# EAGLE design BD0005 (EAGLE 9.6.2)
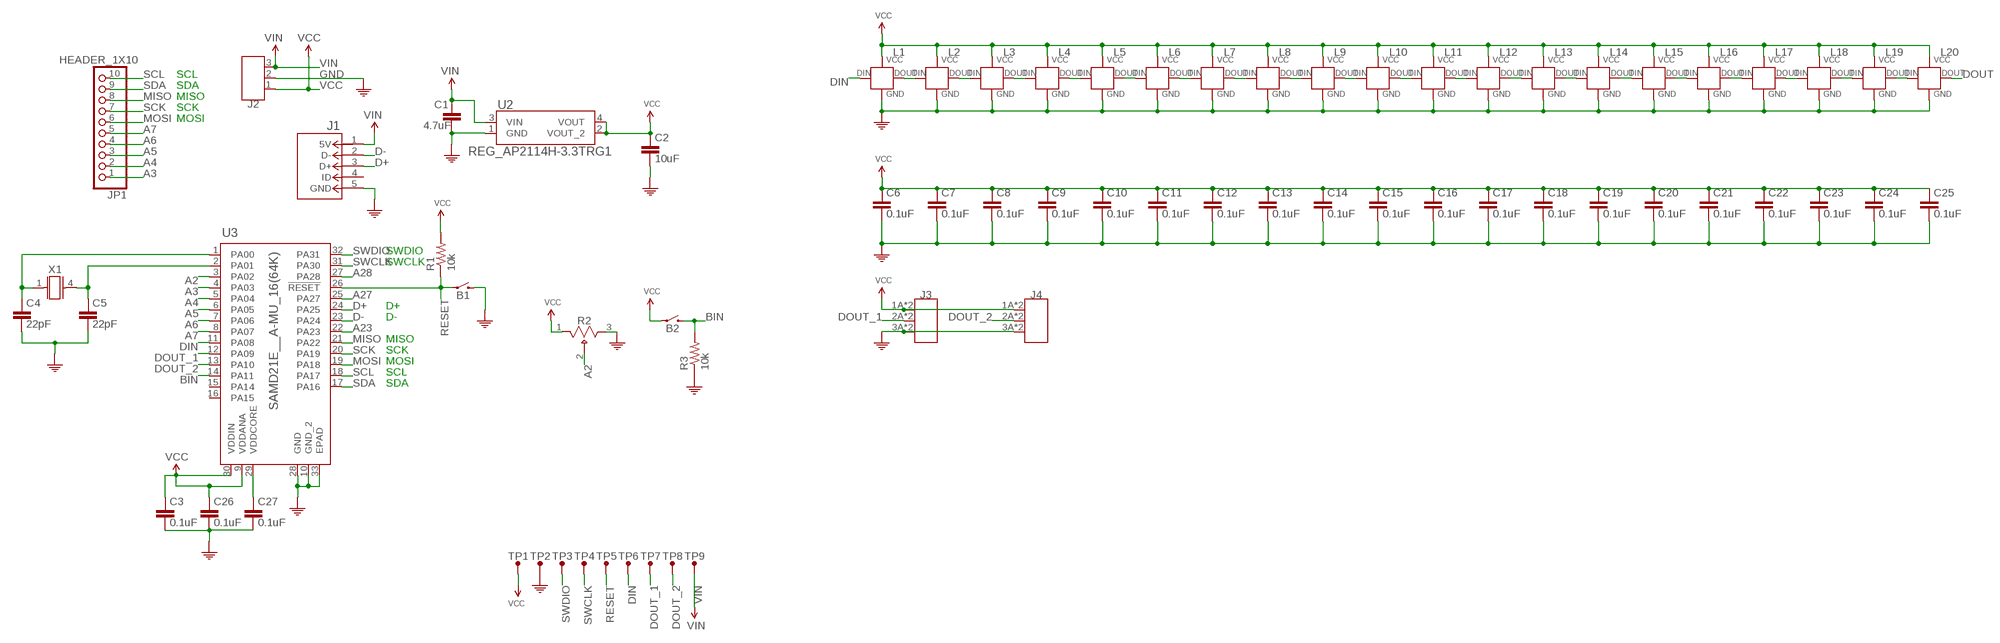
[diagram p0: schematic, sheet 1]

## Parts
B1  SWITCH_EVQ-P7A01P  [4-SMD_BUTTON]
B2  SWITCH_EVQ-P7A01P  [4-SMD_BUTTON]
C1  4.7uF  CAPACITOR-0402  [0402]
C2  10uF  CAPACITOR-0402  [0402]
C3  0.1uF  CAPACITOR-0402  [0402]
C4  22pF  CAPACITOR-0402  [0402]
C5  22pF  CAPACITOR-0402  [0402]
C6  0.1uF  CAPACITOR-0402  [0402]
C7  0.1uF  CAPACITOR-0402  [0402]
C8  0.1uF  CAPACITOR-0402  [0402]
C9  0.1uF  CAPACITOR-0402  [0402]
C10  0.1uF  CAPACITOR-0402  [0402]
C11  0.1uF  CAPACITOR-0402  [0402]
C12  0.1uF  CAPACITOR-0402  [0402]
C13  0.1uF  CAPACITOR-0402  [0402]
C14  0.1uF  CAPACITOR-0402  [0402]
C15  0.1uF  CAPACITOR-0402  [0402]
C16  0.1uF  CAPACITOR-0402  [0402]
C17  0.1uF  CAPACITOR-0402  [0402]
C18  0.1uF  CAPACITOR-0402  [0402]
C19  0.1uF  CAPACITOR-0402  [0402]
C20  0.1uF  CAPACITOR-0402  [0402]
C21  0.1uF  CAPACITOR-0402  [0402]
C22  0.1uF  CAPACITOR-0402  [0402]
C23  0.1uF  CAPACITOR-0402  [0402]
C24  0.1uF  CAPACITOR-0402  [0402]
C25  0.1uF  CAPACITOR-0402  [0402]
C26  0.1uF  CAPACITOR-0402  [0402]
C27  0.1uF  CAPACITOR-0402  [0402]
J1  CONN_MICROUSB_FEMALE  [CON00679_5]
J2  HEADER_1X3  [1X03-CLEANBIG]
J3  HEADER_1X3FEMALE  [F3SMD_RIGHTANGLE]
J4  HEADER_1X3FEMALE  [F3SMD_RIGHTANGLE]
JP1  HEADER_1X10  [1X10-BIG]
L1  WS2812B-B  [SK6812-B]
L2  WS2812B-B  [SK6812-B]
L3  WS2812B-B  [SK6812-B]
L4  WS2812B-B  [SK6812-B]
L5  WS2812B-B  [SK6812-B]
L6  WS2812B-B  [SK6812-B]
L7  WS2812B-B  [SK6812-B]
L8  WS2812B-B  [SK6812-B]
L9  WS2812B-B  [SK6812-B]
L10  WS2812B-B  [SK6812-B]
L11  WS2812B-B  [SK6812-B]
L12  WS2812B-B  [SK6812-B]
L13  WS2812B-B  [SK6812-B]
L14  WS2812B-B  [SK6812-B]
L15  WS2812B-B  [SK6812-B]
L16  WS2812B-B  [SK6812-B]
L17  WS2812B-B  [SK6812-B]
L18  WS2812B-B  [SK6812-B]
L19  WS2812B-B  [SK6812-B]
L20  WS2812B-B  [SK6812-B]
R1  10k  RESISTOR-0402  [0402]
R2  POT_THUMBWHEEL_3352T-1-104LF  [THUMBWHEEL]
R3  10k  RESISTOR-0402  [0402]
TP1  VCC  TEST_POINT  [TEST_POINT]
TP2  GND  TEST_POINT  [TEST_POINT]
TP3  DIO  TEST_POINT  [TEST_POINT]
TP4  CLK  TEST_POINT  [TEST_POINT]
TP5  RST  TEST_POINT  [TEST_POINT]
TP6  DIN  TEST_POINT  [TEST_POINT]
TP7  DO1  TEST_POINT  [TEST_POINT]
TP8  DO2  TEST_POINT  [TEST_POINT]
TP9  VIN  TEST_POINT  [TEST_POINT]
U2  REG_AP2114H-3.3TRG1  [SOT-223]
U3  SAMD21E__A-MU_16(64K)  [QFN32_5X5MC_MCH]
X1  XTAL_MC-146-32.7680JKA-A0:ROHS  [4-SMD_FLAT_LEADS]

## Nets
A2: R2.2 U3.3(PA02)
A3: JP1.1 U3.4(PA03)
A4: JP1.2 U3.5(PA04)
A5: JP1.3 U3.6(PA05)
A6: JP1.4 U3.7(PA06)
A7: JP1.5 U3.8(PA07)
A23: U3.22(PA23)
A27: U3.25(PA27)
A28: U3.27(PA28)
BIN: B2.2A B2.2B R3.P$2 U3.14(PA11)
D+: J1.3(D+) U3.24(PA25)
D-: J1.2(D-) U3.23(PA24)
DIN: L1.2(DIN) TP6.P$1 U3.11(PA08)
DOUT: L20.4(DOUT)
DOUT_1: J3.2A J3.2B TP7.P$1 U3.12(PA09)
DOUT_2: J4.2A J4.2B TP8.P$1 U3.13(PA10)
GND: B1.2A B1.2B C1.P$2 C2.P$2 C3.P$2 C4.P$2 C5.P$2 C6.P$2 C7.P$2 C8.P$2 C9.P$2 C10.P$2 C11.P$2 C12.P$2 C13.P$2 C14.P$2 C15.P$2 C16.P$2 C17.P$2 C18.P$2 C19.P$2 C20.P$2 C21.P$2 C22.P$2 C23.P$2 C24.P$2 C25.P$2 C26.P$2 C27.P$2 J1.5(GND) J2.2 J3.3A J3.3B J4.3A J4.3B L1.1(VSS) L2.1(VSS) L3.1(VSS) L4.1(VSS) L5.1(VSS) L6.1(VSS) L7.1(VSS) L8.1(VSS) L9.1(VSS) L10.1(VSS) L11.1(VSS) L12.1(VSS) L13.1(VSS) L14.1(VSS) L15.1(VSS) L16.1(VSS) L17.1(VSS) L18.1(VSS) L19.1(VSS) L20.1(VSS) R2.3 R3.P$1 TP2.P$1 U2.1(GND) U3.10(GND_2) U3.28(GND) U3.33(EPAD)
MISO: JP1.8 U3.21(PA22)
MOSI: JP1.6 U3.19(PA18)
N$4: C4.P$1 U3.1(PA00) X1.1
N$5: C5.P$1 U3.2(PA01) X1.4
N$6: C27.P$1 U3.29(VDDCORE)
N$8: L19.4(DOUT) L20.2(DIN)
N$9: L18.4(DOUT) L19.2(DIN)
N$10: L17.4(DOUT) L18.2(DIN)
N$11: L16.4(DOUT) L17.2(DIN)
N$12: L15.4(DOUT) L16.2(DIN)
N$13: L14.4(DOUT) L15.2(DIN)
N$14: L13.4(DOUT) L14.2(DIN)
N$15: L12.4(DOUT) L13.2(DIN)
N$16: L11.4(DOUT) L12.2(DIN)
N$17: L10.4(DOUT) L11.2(DIN)
N$18: L9.4(DOUT) L10.2(DIN)
N$19: L8.4(DOUT) L9.2(DIN)
N$20: L7.4(DOUT) L8.2(DIN)
N$21: L1.4(DOUT) L2.2(DIN)
N$22: L2.4(DOUT) L3.2(DIN)
N$23: L3.4(DOUT) L4.2(DIN)
N$24: L4.4(DOUT) L5.2(DIN)
N$25: L5.4(DOUT) L6.2(DIN)
N$26: L6.4(DOUT) L7.2(DIN)
RESET: B1.1A B1.1B R1.P$1 TP5.P$1 U3.26(!RESET)
SCK: JP1.7 U3.20(PA19)
SCL: JP1.10 U3.18(PA17)
SDA: JP1.9 U3.17(PA16)
SWCLK: TP4.P$1 U3.31(PA30)
SWDIO: TP3.P$1 U3.32(PA31)
VCC: B2.1A B2.1B C2.P$1 C3.P$1 C6.P$1 C7.P$1 C8.P$1 C9.P$1 C10.P$1 C11.P$1 C12.P$1 C13.P$1 C14.P$1 C15.P$1 C16.P$1 C17.P$1 C18.P$1 C19.P$1 C20.P$1 C21.P$1 C22.P$1 C23.P$1 C24.P$1 C25.P$1 C26.P$1 J2.1 J3.1A J3.1B J4.1A J4.1B L1.3(VDD) L2.3(VDD) L3.3(VDD) L4.3(VDD) L5.3(VDD) L6.3(VDD) L7.3(VDD) L8.3(VDD) L9.3(VDD) L10.3(VDD) L11.3(VDD) L12.3(VDD) L13.3(VDD) L14.3(VDD) L15.3(VDD) L16.3(VDD) L17.3(VDD) L18.3(VDD) L19.3(VDD) L20.3(VDD) R1.P$2 R2.1 TP1.P$1 U2.2(VOUT_2) U2.4(VOUT) U3.9(VDDANA) U3.30(VDDIN)
VIN: C1.P$1 J1.1(5V) J2.3 TP9.P$1 U2.3(VIN)
Unconnected: J1.4(ID) U3.15(PA14) U3.16(PA15)

## Notes on the sheet
- SCL
- SDA
- MISO
- SCK
- MOSI
- SWDIO
- SWCLK
- D+
- D-
- MISO
- SCK
- MOSI
- SCL
- SDA

## Library data of the parts
B1 B2 = DroidForge:SWITCH_EVQ-P7A01P; 0-DESC: SWITCH TACTILE SPST-NO 0.05A 12V; 1-MN: Panasonic Electronic Components; 2-MPN: EVQ-P7A01P; 5-DK_PN: P16763CT-ND; 6-MR_PN: 667-EVQP7A01P
C1-C27 = DroidForge:CAPACITOR
J1 = DroidForge:CONN_MICROUSB_FEMALE; 0-DESC: CONN RCPT USB2.0 MICRO B SMD R/A; 1-MN: Molex; 2-MPN: 1050171001; 5-DK_PN: WM11262CT-ND; 6-MR_PN: 538-105017-1001
J2 = DroidForge:HEADER_1X3
J3 J4 = DroidForge:HEADER_1X3; 0-DESC: CONN RCPT 3POS 0.1 TIN SMD R/A; 1-MN: Samtec Inc.; 2-MPN: SMH-103-02-T-S-TR; 3-ALT_MN: GCT; 4-ALT_MPN: BG300-03-A-L-A; 5-DK_PN: SAM14542CT-ND
JP1 = DroidForge:HEADER_1X10: Pin header 1x10 0.1" spacing With round pins
L1-L20 = DroidForge:WS2812B; 0-DESC: NeoPixel Addressable LED; 1-MN: Worldsemi; 2-MPN: WS2812B-B
R1 R3 = DroidForge:RESISTOR
R2 = DroidForge:POT_THUMBWHEEL_3352T-1-104LF; 0-DESC: THUMBWHEEL POT 100K OHM 0.5W TOP; 1-MN: Bourns Inc.; 2-MPN: 3352T-1-104LF; 5-DK_PN: 3352T-104LF-ND; 6-MR_PN: 652-3352T-1-104LF
TP1-TP9 = DroidForge:TEST_POINT
U2 = DroidForge:REG_AP2114H-3.3TRG1; 0-DESC: IC REG LINEAR 3.3V 1A SOT223; 1-MN: Diodes Incorporated; 2-MPN: AP2114H-3.3TRG1; 5-DK_PN: AP2114H-3.3TRG1DICT-ND; 6-MR_PN: 621-AP2114H-3.3TRG1
U3 = DroidForge:SAMD21E__A-MU; 0-DESC: ARM® Cortex®-M0+ Automotive, AEC-Q100, SAM D21E Microcontroller IC 32-Bit 48MHz 64KB (64K x 8) FLASH 32-QFN (5x5); 1-MN: Microchip Technology; 2-MPN: ATSAMD21E16B-MFT; 5-DK_PN: ATSAMD21E16B-MFTCT-ND
X1 = DroidForge:XTAL_MC-146-32.7680JKA-A0:ROHS; 0-DESC: CRYSTAL 32.7680 KHZ 12.5PF SMD; 1-MN: EPSON; 2-MPN: MC-146 32.7680KA-A0:ROHS; 5-DK_PN: SER4091CT-ND

## Board
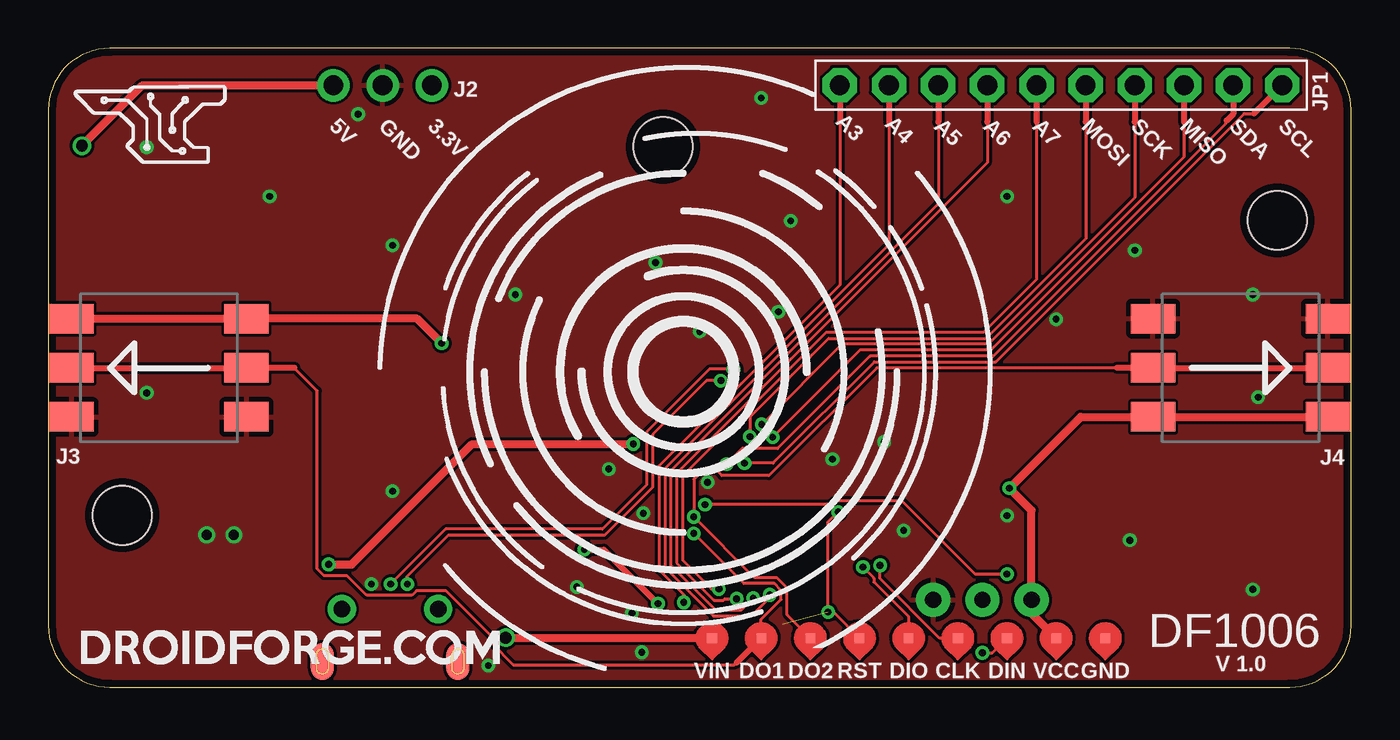
[diagram p1: board, top side]
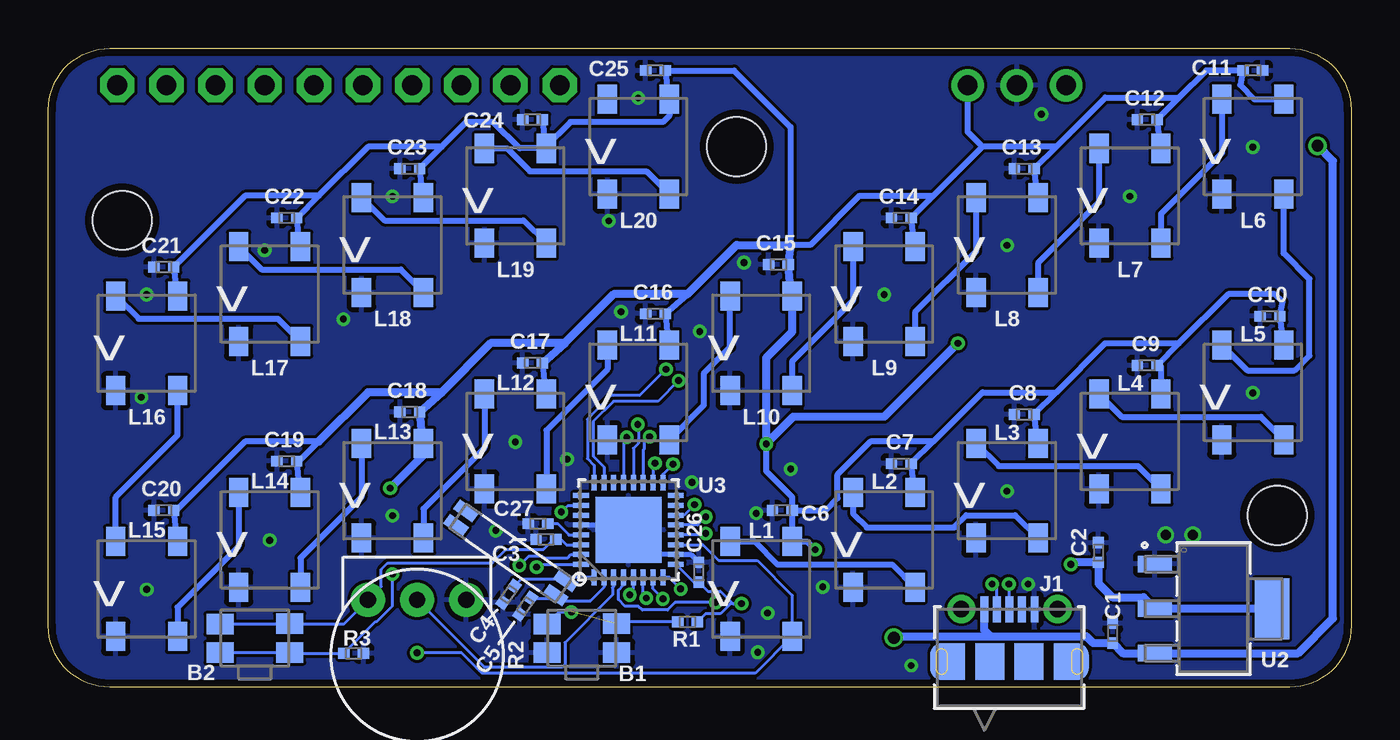
[diagram p2: board, bottom side, seen from below]

Size 67.31 x 33.02 mm. Coordinates in mm from the lower left corner, seen from the top.
Outline: 0,29.84 0,3.17 arc90 3.17,0 64.14,0 arc90 67.31,3.17 67.31,29.84 arc90 64.14,33.02 3.17,33.02 arc90 0,29.84
Copper layers (1*16): Top 0.035mm / dielectric 1.5mm / Bottom 0.035mm
Design rules "default *": minimum track width 6mil, minimum drill 0.3mm, track to track 6mil, track to pad 6mil, pad to pad 6mil, via to via 6mil, smd to smd 6mil, copper to edge 15mil, drill to drill 6mil, minimum pad ring 10mil, minimum via ring 7mil, stop-mask expansion 3mil, vias tented up to drill 25mil, thermal gap 10mil
Holes 3.05 mm at 31.75,27.94 3.81,8.89 63.5,24.13

### Footprints (pad centres in the part's own frame; a part is rotated, then mirrored left to right if it is on the bottom)
4-SMD_BUTTON = smd 1.4 x 1.05: 1A -1.8,0.725; 1B 1.8,0.75; 2A -1.8,-0.75; 2B 1.8,-0.75
0402 = smd 0.584 x 0.559: P$1 -0.508,0; P$2 0.508,0
CON00679_5 = smd 0.406 x 1.346: 1 -1.302,2.504; 2 -0.652,2.504; 3 -0.002,2.504; 4 0.648,2.504; 5 1.298,2.504 | drill 0.864 pad 1.448: 6 -2.489,2.515; 7 2.489,2.515 | smd 1.499 x 1.905: 8 -1.002,-0.196; 9 0.998,-0.196 | smd 1.194 x 1.905 bottom: 10 -3.502,-0.196; 11 3.498,-0.196 | smd 1.194 x 1.905: 10_B -3.502,-0.196; 11_B 3.498,-0.196 | smd 1.201 x 1.905: 12 -2.902,-0.196; 13 2.898,-0.196
1X03-CLEANBIG = drill 1.016 pad 1.676: 1 -2.54,0; 2 0,0; 3 2.54,0
F3SMD_RIGHTANGLE = smd 1.524 x 2.286: 1A -2.54,4.521; 1B -2.54,-4.521; 2A 0,4.521; 2B 0,-4.521; 3A 2.54,4.521; 3B 2.54,-4.521
1X10-BIG = drill 1.016 pad 1.778 octagon: 1 -11.43,0; 2 -8.89,0; 3 -6.35,0; 4 -3.81,0; 5 -1.27,0; 6 1.27,0; 7 3.81,0; 8 6.35,0; 9 8.89,0; 10 11.43,0
SK6812-B = smd 1.5 x 1: 1 -2.45,1.6; 2 -2.45,-1.6; 3 2.45,-1.6; 4 2.45,1.6
THUMBWHEEL = drill 0.85 pad 1.778: 1 -2.54,2.865; 2 0,2.865; 3 2.54,2.865
TEST_POINT = smd 0.508 x 0.508: P$1 0,0
SOT-223 = smd 0.851 x 1.761: 1 -2.3,-3.025; 2 0,-3.025; 3 2.3,-3.025 | smd 3.151 x 1.761: 4 0,3.025
QFN32_5X5MC_MCH = smd 0.808 x 0.255: 1 -2.449,1.778; 2 -2.449,1.27; 3 -2.449,0.762; 4 -2.449,0.254; 5 -2.449,-0.254; 6 -2.449,-0.762; 7 -2.449,-1.27; 8 -2.449,-1.778; 17 2.449,-1.778; 18 2.449,-1.27; 19 2.449,-0.762; 20 2.449,-0.254; 21 2.449,0.254; 22 2.449,0.762; 23 2.449,1.27; 24 2.449,1.778 | smd 0.255 x 0.808: 9 -1.778,-2.449; 10 -1.27,-2.449; 11 -0.762,-2.449; 12 -0.254,-2.449; 13 0.254,-2.449; 14 0.762,-2.449; 15 1.27,-2.449; 16 1.778,-2.449; 25 1.778,2.449; 26 1.27,2.449; 27 0.762,2.449; 28 0.254,2.449; 29 -0.254,2.449; 30 -0.762,2.449; 31 -1.27,2.449; 32 -1.778,2.449 | smd 3.404 x 3.404: 33 0,0
4-SMD_FLAT_LEADS = smd 1.2 x 0.6: 1 -3.15,-0.45; 2 3.15,-0.45; 3 3.15,0.45; 4 -3.15,0.45

### Placement (x,y rotation side)
B1  39.75,2.54 0 bottom
B2  56.64,2.54 0 bottom
C1  12.32,2.79 90 bottom
C2  13.06,6.96 90 bottom
C3  41.61,7.65 180 bottom
C4  43.54,4.8 235 bottom
C5  42.67,4.19 235 bottom
C6  29.39,9.14 180 bottom
C7  23.24,11.56 180 bottom
C8  16.89,14.1 180 bottom
C9  10.54,16.64 180 bottom
C10  4.19,19.18 180 bottom
C11  5.08,31.88 0 bottom
C12  10.54,29.34 180 bottom
C13  16.89,26.8 180 bottom
C14  23.24,24.26 180 bottom
C15  29.59,21.84 180 bottom
C16  35.94,19.3 180 bottom
C17  42.29,16.76 180 bottom
C18  48.64,14.22 180 bottom
C19  54.99,11.68 180 bottom
C20  61.34,9.14 180 bottom
C21  61.34,21.72 180 bottom
C22  54.99,24.26 180 bottom
C23  48.64,26.8 180 bottom
C24  42.29,29.34 180 bottom
C25  35.94,31.88 180 bottom
C26  33.71,5.94 90 bottom
C27  42.01,8.46 180 bottom
J1  17.65,1.52 0 bottom
J2  17.27,31.11 180 top
J3  5.71,16.51 270 top
J4  61.59,16.51 90 top
JP1  52.32,31.11 0 top
L1  30.48,5.08 90 bottom
L2  24.13,7.62 90 bottom
L3  17.78,10.16 90 bottom
L4  11.43,12.7 90 bottom
L5  5.08,15.24 90 bottom
L6  5.08,27.94 90 bottom
L7  11.43,25.4 90 bottom
L8  17.78,22.86 90 bottom
L9  24.13,20.32 90 bottom
L10  30.48,17.78 90 bottom
L11  36.83,15.24 90 bottom
L12  43.18,12.7 90 bottom
L13  49.53,10.16 90 bottom
L14  55.88,7.62 90 bottom
L15  62.23,5.08 90 bottom
L16  62.23,17.78 90 bottom
L17  55.88,20.32 90 bottom
L18  49.53,22.86 90 bottom
L19  43.18,25.4 90 bottom
L20  36.83,27.94 90 bottom
R1  34.29,3.38 0 bottom
R2  48.26,1.65 0 bottom
R3  51.54,1.75 180 bottom
TP1  52.07,2.54 0 top
TP2  54.61,2.54 0 top
TP3  44.45,2.54 0 top
TP4  46.99,2.54 0 top
TP5  41.91,2.54 0 top
TP6  49.53,2.54 0 top
TP7  36.83,2.54 0 top
TP8  39.37,2.54 0 top
TP9  34.29,2.54 0 top
U2  7.11,4.06 270 bottom
U3  37.34,8.13 90 bottom
X1  43.41,6.93 145 bottom

### Tracks (layer width: path | path; a pad name or v marks a point on that pad's centre or on a via)
A2
  Bottom 0.152: U3.3 38.1,5.2 38.16,5.14 38.16,4.76 40.62,2.3 40.62,1.17 40.76,1.04 44.78,1.04 R2.2
A3  (via drill 0.35)
  Top 0.152: 40.89,29.21 40.89,20.77 31.55,11.43 31.55,6.06 32.83,4.78 v32.83,4.38
  Top 0.305: JP1.1 40.89,29.21
  Bottom 0.152: v32.83,4.38 34.93,4.38 35.32,3.99 36.62,3.99 36.83,4.19 37.52,4.19 37.86,4.53 37.86,5.02 37.59,5.28 U3.4
A4  (via drill 0.35)
  Top 0.152: 43.43,29.21 43.43,22.88 31.85,11.3 31.85,6.19 34.35,3.69 36.32,3.69 37.28,4.64 v37.28,4.78
  Top 0.305: JP1.2 43.43,29.21
  Bottom 0.152: v37.28,4.78 37.08,4.97 U3.5
A5  (via drill 0.35)
  Top 0.152: 45.97,29.21 45.97,24.99 32.16,11.18 32.16,6.31 34.48,3.99 35.8,3.99 v36.42,4.61
  Top 0.305: JP1.3 45.97,29.21
  Bottom 0.152: v36.42,4.61 36.58,4.77 U3.6
A6  (via drill 0.35)
  Top 0.152: 48.51,29.21 48.51,27.1 32.46,11.05 32.46,6.44 34.4,4.5 34.88,4.5 34.96,4.57 v35.56,4.57
  Top 0.305: JP1.4 48.51,29.21
  Bottom 0.152: v35.56,4.57 36.07,5.08 U3.7
A7  (via drill 0.35)
  Top 0.152: 51.05,29.21 51.05,21.08 48.31,18.34 40.18,18.34 32.77,10.92 32.77,6.58 34.26,5.08 v34.64,5.08
  Top 0.305: JP1.5 51.05,29.21
  Bottom 0.152: v34.64,5.08 35.24,5.68 U3.8
BIN  (via drill 0.35)
  Top 0.152: v49.53,5.84 47.89,5.84 44.1,9.64 40.57,9.64 40.37,9.44 v33.93,9.44
  Bottom 0.152: B2.2A B2.2B 54.8,1.75 R3.P$2 50.4,3.4 50.34,3.4 49.53,4.21 v49.53,5.84 | v33.93,9.44 34.48,8.89 U3.14
D+  (via drill 0.35)
  Top 0.152: v17.68,5.33 20.53,8.18 28.63,8.18 30.91,10.46 30.91,13.19 34.16,16.44 v35.4,16.44
  Bottom 0.152: J1.3 17.66,5.3 v17.68,5.33 | v35.4,16.44 36.76,15.08 38.24,15.08 39.46,13.86 39.46,11.82 39.12,11.47 U3.24
D-  (via drill 0.35)
  Top 0.152: v18.54,5.33 18.54,5.74 20.68,7.87 28.75,7.87 31.22,10.34 31.22,13.06 34.01,15.85 v34.75,15.85
  Bottom 0.152: J1.2 18.3,5.1 v18.54,5.33 | U3.23 38.61,11.39 39.16,11.95 39.16,13.73 38.12,14.78 35.82,14.78 v34.75,15.85
DIN  (via drill 0.35)
  Top 0.152: v48.26,1.78 48.77,1.78 TP6.P$1
  Bottom 0.152: U3.11 33.49,7.37 32.67,6.55 30.68,6.55 28.88,4.75 L1.2 30.78,0.73 44.91,0.73 45.95,1.78 v48.26,1.78
DOUT_1  (via drill 0.35)
  Top 0.152: TP7.P$1 36.83,3.51 37.86,4.53 37.86,5.02 37.52,5.36 35.94,5.36 v33.35,7.95 | 12.7,16.51 13.9,15.31 13.9,6.11 14.24,5.77 15.43,5.77 16.45,4.75 18.78,4.75 19.02,4.99 20.54,4.99 22.92,2.61 22.92,2.26 24.03,1.15 35.44,1.15 35.56,1.27
  Top 0.305: J3.2B J3.2A 12.7,16.51 | TP7.P$1 35.56,1.27
  Bottom 0.152: v33.35,7.95 33.42,7.87 U3.12
DOUT_2  (via drill 0.35)
  Top 0.152: J4.2B 66.04,16.51 57.81,16.51 57.15,16.51 55.22,16.51 42.8,16.51 37.23,10.94 34.8,10.94 34.56,11.18 33.78,11.18 33.35,10.74 v33.35,8.8 36.49,5.66 37.64,5.66 38.16,5.14 38.16,3.75 TP8.P$1
  Top 0.305: J4.2A 57.15,16.51 | J4.2A 55.22,16.51 | J4.2A 66.04,16.51 | J4.2A 57.81,16.51
  Bottom 0.152: v33.35,8.8 33.77,8.38 U3.13
GND  (via drill 0.35, 0.5)
  Bottom 0.254: U3.28 37.59,8.38 U3.33 36.07,6.86 U3.10 34.11,6.86 C26.P$2
  other vias: 30.73,8.99 28.96,11.28 16,29.62 11.43,25.37 17.78,22.83 24.13,20.29 5.08,27.91 5.08,15.21 17.78,10.13 30.66,1.8 55.88,7.59 62.23,5.05 43.18,12.67 52.07,19.02 62.51,14.99 38.35,24.1 33.66,18.39 49.53,8.86 16.69,5.33 9.58,7.87 8.18,7.87 27.3,5.18 30.15,3.84 22.73,1.12 40.51,11.79 34.06,10.59 31.37,21.95 37.72,19.41 49.53,25.37 36.83,30.45 56.13,22.58 62.23,20.29 44.2,8.1
  pour Top: -2.54,-2.54 69.85,-2.54 69.85,35.56 -2.54,35.56
  pour Bottom: -2.54,-2.54 69.85,-2.54 69.85,35.56 -2.54,35.56
MISO  (via drill 0.35)
  Top 0.152: 58.67,29.21 58.67,27.41 48.69,17.42 41.93,17.42 v37.42,12.92
  Top 0.305: JP1.8 58.67,29.21
  Bottom 0.152: v37.42,12.92 37.59,12.75 U3.21
MOSI  (via drill 0.35)
  Top 0.152: 53.59,29.21 53.59,23.19 48.44,18.03 40.31,18.03 36.25,13.97 v36.25,12.95
  Top 0.305: JP1.6 53.59,29.21
  Bottom 0.152: v36.25,12.95 36.52,12.68 36.52,12.3 36.58,12.25 U3.19
N$4
  Bottom 0.152: C4.P$1 42.86,5.6 40.61,5.6 X1.1 40.39,5.68 U3.1
N$5
  Bottom 0.152: U3.2 38.61,5.17 39.31,4.47 41.09,4.47 X1.4 41.24,4.61 C5.P$1
N$6
  Bottom 0.152: C27.P$1 41,8.46 40.41,7.87 U3.29
N$8
  Bottom 0.305: L20.2 36.41,26.67 42.43,26.67 43.61,27.85 L19.4
N$9
  Bottom 0.305: L18.4 49.95,24.13 42.76,24.13 L19.2
N$10
  Bottom 0.305: L17.4 56.3,21.59 49.11,21.59 L18.2
N$11
  Bottom 0.305: L16.4 62.65,19.05 55.46,19.05 L17.2
N$12
  Bottom 0.305: L15.4 63.83,9.83 60.63,13.03 L16.2
N$13
  Bottom 0.305: L14.4 57.48,7.29 60.63,4.14 L15.2
N$14
  Bottom 0.305: L13.4 51.13,9.83 54.28,6.68 L14.2
N$15
  Bottom 0.305: L12.4 44.78,12.37 47.93,9.22 L13.2
N$16
  Bottom 0.305: L11.4 38.43,16.43 41.58,13.28 L12.2
N$17
  Bottom 0.305: L10.4 32.08,17.58 33.45,16.2 33.45,14.57 L11.2
N$18
  Bottom 0.305: L9.4 25.73,19.99 28.88,16.84 L10.2
N$19
  Bottom 0.305: L8.4 19.38,22.53 22.53,19.38 L9.2
N$20
  Bottom 0.305: L7.4 13.03,25.07 16.18,21.92 L8.2
N$21
  Bottom 0.305: L2.2 23.71,6.35 29.63,6.35 30.81,7.53 L1.4
N$22
  Bottom 0.305: L3.2 17.36,8.89 19.88,8.89 20.52,8.26 25.02,8.26 25.73,8.97 L2.4
N$23
  Bottom 0.305: L3.4 18.2,11.43 11.01,11.43 L4.2
N$24
  Bottom 0.305: L4.4 11.85,13.97 4.66,13.97 L5.2
N$25
  Bottom 0.305: L6.2 3.48,22.43 2.16,21.11 2.16,17.14 2.92,16.38 5.37,16.38 L5.4
N$26
  Bottom 0.305: L6.4 6.68,27.61 9.83,24.46 L7.2
RESET  (via drill 0.35)  (1 unrouted)
  Top 0.152: TP5.P$1 40.56,3.89 v40.28,3.89 40.28,8.53 v40.81,9.06
  Bottom 0.152: B1.1A 40.93,3.89 v40.28,3.89 | v40.81,9.06 40.47,9.4 U3.26 | 34.89,3.29 R1.P$1 37.86,3.38 B1.1B
SCK  (via drill 0.35)
  Top 0.152: 56.13,29.21 56.13,25.3 48.57,17.73 41.01,17.73 v36.86,13.58
  Top 0.305: JP1.7 56.13,29.21
  Bottom 0.152: v36.86,13.58 36.83,13.55 36.83,12.61 37.08,12.36 U3.20
SCL  (via drill 0.35)
  Top 0.152: 62.29,29.65 61.78,29.65 48.95,16.82 42.67,16.82 37.44,11.59 v35.97,11.59
  Top 0.305: 62.29,29.65 JP1.10
  Bottom 0.152: v35.97,11.59 36.07,11.49 U3.18
SDA  (via drill 0.35)
  Top 0.152: 60.88,29.29 60.83,29.24 60.83,29.13 48.82,17.12 42.45,17.12 37.67,12.34 35.85,12.34 v35.04,11.52
  Top 0.305: JP1.9 61.21,29.62 60.88,29.29
  Bottom 0.152: v35.04,11.52 35.56,11 U3.17
SWCLK  (via drill 0.35)
  Top 0.152: TP4.P$1 46.05,2.54 42.97,5.62 v42.97,6.3
  Bottom 0.152: v42.97,6.3 42.48,6.79 41.82,6.79 41.71,6.68 40.5,6.68 40.32,6.86 U3.31
SWDIO  (via drill 0.35)
  Top 0.152: TP3.P$1 44.45,3.64 42.65,5.45 42.65,5.65 v42.09,6.21
  Bottom 0.152: v42.09,6.21 41.95,6.35 U3.32
VCC  (via drill 0.35)
  Top 0.305: J4.1A 57.4,13.97 | v27.69,7.11 28.7,7.11 v31.5,4.32
  Top 0.406: TP1.P$1 50.8,3.81 R2.1 50.8,9.14 v49.66,10.29 53.34,13.97 57.4,13.97 J4.1B | v30.23,12.57 21.89,12.57 15.67,6.35 v14.48,6.35 | v20.32,17.78 19.05,19.05 J3.1A J3.1B
  Bottom 0.152: B2.1A 54.87,3.27 B2.1B 52.03,3.29 R2.1 50.11,5.21 50.11,6.08 49.77,6.42 44.38,6.42 43.66,7.14 41.73,7.14 41.22,7.64 C3.P$1 40.83,7.64 40.55,7.37 U3.30 | R1.P$2 33.36,3.8 32.59,3.8 32.08,4.32 v31.5,4.32 31.94,4.32 32.59,4.97 33.24,4.97 C26.P$1 33.98,5.44 U3.9
  Bottom 0.305: 8.89,30.48 7.49,31.88 C11.P$1 5.73,31.13 4.99,30.39 L6.3 | 15.24,27.94 12.7,30.48 8.89,30.48 | 21.59,25.4 19.05,27.94 | 21.59,12.7 19.05,15.24 15.24,15.24 | 53.34,25.4 50.8,27.94 46.99,27.94 | 15.24,27.94 19.05,27.94 | 21.59,25.4 25.4,25.4 27.94,22.86 28.96,22.86 | L10.3 28.94,20.29 | 28.94,22.84 28.96,22.86 | 28.96,22.86 28.96,28.96 31.88,31.88 C25.P$1 35.29,30.45 L20.3 35.23,29.54 35.56,29.21 40.34,29.21 41.64,27.91 | L9.3 22.59,22.83 C14.P$1 21.59,25.4 | 15.24,27.94 C13.P$1 16.24,25.37 L8.3 | L7.3 9.89,27.91 C12.P$1 8.89,30.48 | C17.P$1 41.64,15.21 L12.3 | 40.64,17.77 40.64,17.78 | 46.99,15.22 46.99,15.24 | 47.99,12.67 L13.3 47.93,12.01 | L14.3 54.34,10.13 C19.P$1 54.34,11.7 53.34,12.7 57.15,12.7 60.69,9.16 C20.P$1 60.69,7.59 L15.3 | 34.29,20.32 34.29,20.3 C16.P$1 35.29,17.75 L11.3 | 21.59,12.7 24.84,12.7 26.54,11.01 26.54,9.78 27.17,9.14 C6.P$1 | 15.24,15.24 C8.P$1 16.24,12.67 L3.3 | 21.59,12.7 C7.P$1 22.59,10.13 L2.3 | v30.23,12.57 30.23,11.18 28.88,9.83 C6.P$1 | L4.3 9.83,16.58 C9.P$1 8.89,17.78 | L5.3 3.54,17.75 C10.P$1 3.54,19.92 3.94,20.32 6.35,20.32 8.89,17.78 | 15.24,15.24 12.7,17.78 8.89,17.78 | 53.34,25.4 57.15,25.4 C21.P$1 60.69,20.29 L16.3 | L17.3 54.34,22.83 C22.P$1 53.34,25.4 | 46.99,27.94 C23.P$1 47.99,25.37 L18.3 | C24.P$1 41.64,27.91 | 41.64,27.91 L19.3 42.96,27.85 44.32,29.21 45.72,29.21 46.99,27.94 | 19.05,27.94 19.81,28.7 J2.1 | C6.P$1 L1.3 | L1.3 | L1.3 28.1,7.53 v27.69,7.11
  Bottom 0.406: 53.34,12.7 50.8,15.24 46.99,15.24 44.45,17.78 40.64,17.78 38.1,20.32 34.29,20.32 31.75,22.86 28.96,22.86 | L10.3 28.88,18.36 30.23,17.02 v30.23,12.57 28.83,13.97 24.13,13.97 v20.32,17.78 | 28.94,20.29 C15.P$1 28.94,22.84 | C17.P$1 40.64,17.77 | 46.99,15.22 C18.P$1 47.99,12.67 | v14.48,6.35 14.38,6.45 C2.P$1 13.06,5.36 12.35,4.65 10.72,4.65 U2.2 U2.4 | v49.66,10.29 47.93,12.01
VIN  (via drill 0.6)
  Top 0.406: v1.73,27.99 4.85,31.11 J2.3 | v23.62,2.56 34.27,2.56 TP9.P$1
  Bottom 0.406: v1.73,27.99 0.94,27.2 0.94,3.56 2.73,1.76 U2.3 11.8,1.76 C1.P$1 13.34,2.29 13.69,2.64 18.64,2.64 | 18.64,2.64 23.54,2.64 v23.62,2.56 | 18.64,2.64 18.95,2.95 J1.1

### Text on the board
tPlace: 5V | GND | 3.3V | A3 | A4 | A5 | A6 | A7 | MOSI | SCK | MISO | SDA | SCL | DF1006 | V 1.0